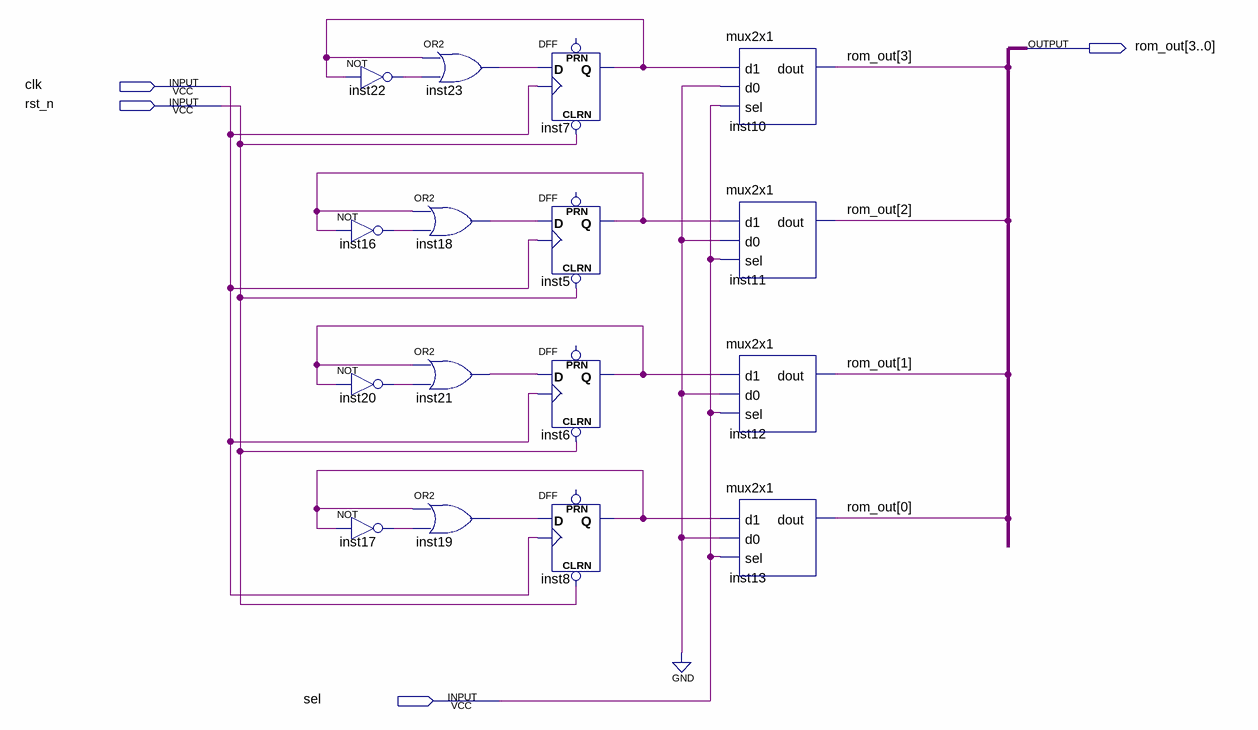
[diagram p0: schematic sheet]
// Quartus schematic rom_1111.bdf as structural Verilog: 16 symbols, 4 pins
module rom_1111 (
  input  clk,
  input  rst_n,
  input  sel,
  output [3:0] rom_out
);

  wire inst5_q, inst6_q, inst7_q, inst8_q, inst16_out, inst17_out, inst18_out, inst19_out, inst20_out,
       inst21_out, inst22_out, inst23_out;

  not inst22 (inst22_out, inst7_q);
  not inst16 (inst16_out, inst5_q);
  not inst20 (inst20_out, inst6_q);
  not inst17 (inst17_out, inst8_q);
  or inst23 (inst23_out, inst7_q, inst22_out);
  or inst18 (inst18_out, inst5_q, inst16_out);
  or inst21 (inst21_out, inst6_q, inst20_out);
  or inst19 (inst19_out, inst8_q, inst17_out);
  DFF inst7 (.CLRN(rst_n), .CLK(clk), .D(inst23_out), .Q(inst7_q));  // open: PRN
  DFF inst5 (.CLRN(rst_n), .CLK(clk), .D(inst18_out), .Q(inst5_q));  // open: PRN
  DFF inst6 (.CLRN(rst_n), .CLK(clk), .D(inst21_out), .Q(inst6_q));  // open: PRN
  DFF inst8 (.CLRN(rst_n), .CLK(clk), .D(inst19_out), .Q(inst8_q));  // open: PRN
  mux2x1 inst10 (.d1(inst7_q), .d0(1'b0), .sel(sel), .dout(rom_out[3]));
  mux2x1 inst11 (.d1(inst5_q), .d0(1'b0), .sel(sel), .dout(rom_out[2]));
  mux2x1 inst12 (.d1(inst6_q), .d0(1'b0), .sel(sel), .dout(rom_out[1]));
  mux2x1 inst13 (.d1(inst8_q), .d0(1'b0), .sel(sel), .dout(rom_out[0]));
endmodule
